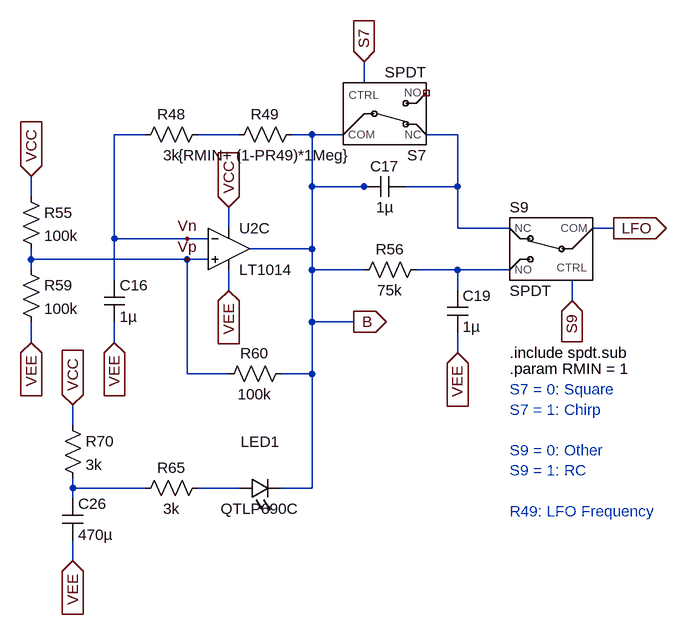
[diagram p0: schematic LFO.asc]
LFO.asc, the LTspice schematic file:
Version 4.1
SHEET 1 1112 792
WIRE 256 -96 256 -128
WIRE -80 -16 -128 -16
WIRE 64 -16 0 -16
WIRE 176 -16 144 -16
WIRE 224 -16 176 -16
WIRE 400 -16 352 -16
WIRE 176 64 176 -16
WIRE 256 64 176 64
WIRE 272 64 256 64
WIRE 400 64 400 -16
WIRE 400 64 320 64
WIRE -256 80 -256 48
WIRE 48 128 48 96
WIRE 400 128 400 64
WIRE 480 128 400 128
WIRE 640 128 608 128
WIRE -128 144 -128 -16
WIRE -16 144 -128 144
WIRE 16 144 -16 144
WIRE 176 160 176 64
WIRE 176 160 80 160
WIRE -256 176 -256 160
WIRE -16 176 -256 176
WIRE 16 176 -16 176
WIRE -256 192 -256 176
WIRE 176 192 176 160
WIRE 256 192 176 192
WIRE 400 192 336 192
WIRE 480 192 400 192
WIRE -128 208 -128 144
WIRE 48 224 48 192
WIRE 400 224 400 192
WIRE 576 240 576 208
WIRE 176 272 176 192
WIRE 240 272 176 272
WIRE -256 304 -256 272
WIRE -128 304 -128 272
WIRE 400 320 400 288
WIRE -16 352 -16 176
WIRE 48 352 -16 352
WIRE 176 352 176 272
WIRE 176 352 128 352
WIRE -192 432 -192 400
WIRE -192 528 -192 512
WIRE -80 528 -192 528
WIRE 64 528 0 528
WIRE 176 528 176 352
WIRE 176 528 128 528
WIRE -192 544 -192 528
WIRE -192 640 -192 608
FLAG 256 -128 S7
IOPIN 256 -128 In
FLAG 576 240 S9
IOPIN 576 240 In
FLAG 48 96 VCC
IOPIN 48 96 In
FLAG 48 224 VEE
IOPIN 48 224 In
FLAG -256 48 VCC
IOPIN -256 48 In
FLAG -256 304 VEE
IOPIN -256 304 In
FLAG -16 176 Vp
FLAG -128 304 VEE
IOPIN -128 304 In
FLAG -16 144 Vn
FLAG 240 272 B
IOPIN 240 272 Out
FLAG 400 320 VEE
IOPIN 400 320 In
FLAG 640 128 LFO
IOPIN 640 128 Out
FLAG -192 400 VCC
IOPIN -192 400 In
FLAG -192 640 VEE
IOPIN -192 640 In
SYMBOL OpAmps\\LT1014 48 96 R0
SYMATTR InstName U2C
SYMBOL res -272 64 R0
SYMATTR InstName R55
SYMATTR Value 100k
SYMBOL res -272 176 R0
SYMATTR InstName R59
SYMATTR Value 100k
SYMBOL res 144 336 R90
WINDOW 0 0 56 VBottom 2
WINDOW 3 32 56 VTop 2
SYMATTR InstName R60
SYMATTR Value 100k
SYMBOL spdt 256 -48 R180
SYMATTR InstName S7
SYMBOL spdt 576 160 R0
SYMATTR InstName S9
SYMBOL cap -144 208 R0
SYMATTR InstName C16
SYMATTR Value 1µ
SYMBOL res 16 -32 R90
WINDOW 0 0 56 VBottom 2
WINDOW 3 32 56 VTop 2
SYMATTR InstName R48
SYMATTR Value 3k
SYMBOL res 160 -32 R90
WINDOW 0 0 56 VBottom 2
WINDOW 3 32 56 VTop 2
SYMATTR InstName R49
SYMATTR Value {RMIN+ (1-PR49)*1Meg}
SYMBOL res 352 176 R90
WINDOW 0 0 56 VBottom 2
WINDOW 3 32 56 VTop 2
SYMATTR InstName R56
SYMATTR Value 75k
SYMBOL cap 384 224 R0
SYMATTR InstName C19
SYMATTR Value 1µ
SYMBOL cap 320 48 R90
WINDOW 0 0 32 VBottom 2
WINDOW 3 32 32 VTop 2
SYMATTR InstName C17
SYMATTR Value 1µ
SYMBOL LED 64 544 R270
WINDOW 0 72 32 VTop 2
WINDOW 3 0 32 VBottom 2
SYMATTR InstName LED1
SYMATTR Value QTLP690C
SYMBOL res -208 416 R0
SYMATTR InstName R70
SYMATTR Value 3k
SYMBOL cap -208 544 R0
SYMATTR InstName C26
SYMATTR Value 470µ
SYMBOL res 16 512 R90
WINDOW 0 0 56 VBottom 2
WINDOW 3 32 56 VTop 2
SYMATTR InstName R65
SYMATTR Value 3k
TEXT 480 344 Left 2 !.param RMIN = 1
TEXT 480 376 Left 2 ;S7 = 0: Square\nS7 = 1: Chirp\n \nS9 = 0: Other\nS9 = 1: RC\n \nR49: LFO Frequency
TEXT 480 320 Left 2 !.include spdt.sub

The netlist it stands for:
* LFO.asc
X§U2C Vp Vn VCC VEE B LT1014  ; pins In+ In- V+ V- OUT
R55 VCC Vp 100k
R59 Vp VEE 100k
R60 B Vp 100k
X§S7 B NC_01 N002 S7 SPDT  ; pins COM NO NC CTRL
X§S9 LFO N003 N002 S9 SPDT  ; pins COM NO NC CTRL
C16 Vn VEE 1µ
R48 N001 Vn 3k
R49 B N001 {RMIN+ (1-PR49)*1Meg}
R56 N003 B 75k
C19 N003 VEE 1µ
C17 N002 B 1µ
D§LED1 N005 B QTLP690C
R70 VCC N004 3k
C26 N004 VEE 470µ
R65 N005 N004 3k
.model D D
.lib standard.dio
.param RMIN = 1
* S7 = 0: Square
* S7 = 1: Chirp
* S9 = 0: Other
* S9 = 1: RC
* R49: LFO Frequency
.include spdt.sub
.backanno
.end